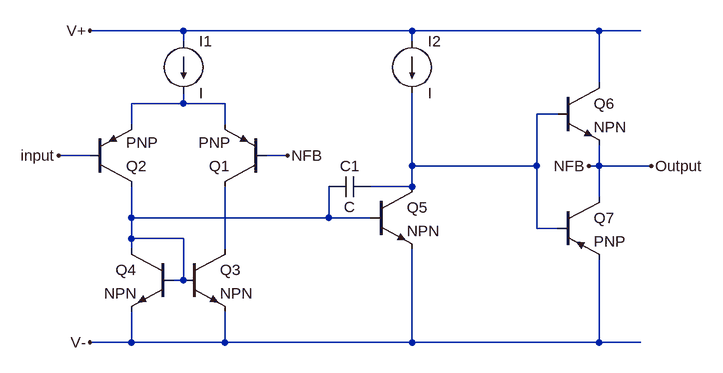
[diagram p0: schematic three_stage_pa.asc]
three_stage_pa.asc, the LTspice schematic file:
Version 4
SHEET 1 880 680
WIRE -192 32 -336 32
WIRE 160 32 -192 32
WIRE 448 32 160 32
WIRE 512 32 448 32
WIRE -192 48 -192 32
WIRE 160 48 160 32
WIRE 448 112 448 32
WIRE -192 144 -192 128
WIRE -192 144 -272 144
WIRE -128 144 -192 144
WIRE 384 160 352 160
WIRE -272 176 -272 144
WIRE -128 176 -128 144
WIRE -336 224 -384 224
WIRE -32 224 -64 224
WIRE 160 240 160 128
WIRE 352 240 352 160
WIRE 352 240 160 240
WIRE 448 240 448 208
WIRE 448 240 432 240
WIRE 528 240 448 240
WIRE 160 272 160 240
WIRE 160 272 96 272
WIRE 448 288 448 240
WIRE -272 320 -272 272
WIRE 32 320 32 272
WIRE 32 320 -272 320
WIRE 96 320 32 320
WIRE 352 336 352 240
WIRE 384 336 352 336
WIRE -272 352 -272 320
WIRE -192 352 -272 352
WIRE -272 368 -272 352
WIRE -128 368 -128 272
WIRE -192 416 -192 352
WIRE -192 416 -208 416
WIRE -272 512 -272 464
WIRE -272 512 -336 512
WIRE -128 512 -128 464
WIRE -128 512 -272 512
WIRE 160 512 160 368
WIRE 160 512 -128 512
WIRE 448 512 448 384
WIRE 448 512 160 512
WIRE 512 512 448 512
FLAG -384 224 input
FLAG -32 224 NFB
FLAG -336 32 V+
FLAG -336 512 V-
FLAG 528 240 Output
FLAG 432 240 NFB
SYMBOL current -192 48 R0
SYMATTR InstName I1
SYMBOL pnp -64 272 R180
SYMATTR InstName Q1
SYMBOL pnp -336 272 M180
SYMATTR InstName Q2
SYMBOL npn -192 368 R0
SYMATTR InstName Q3
SYMBOL npn -208 368 M0
SYMATTR InstName Q4
SYMBOL npn 96 272 R0
SYMATTR InstName Q5
SYMBOL cap 96 256 R90
WINDOW 0 0 32 VBottom 2
WINDOW 3 32 32 VTop 2
SYMATTR InstName C1
SYMBOL current 160 48 R0
SYMATTR InstName I2
SYMBOL npn 384 112 R0
SYMATTR InstName Q6
SYMBOL pnp 384 288 R0
SYMATTR InstName Q7

The netlist it stands for:
* three_stage_pa.asc
I1 V+ N001 I
Q1 N004 Output N001 0 PNP
Q2 N003 input N001 0 PNP
Q3 N004 N003 V- 0 NPN
Q4 N003 N003 V- 0 NPN
Q5 N002 N003 V- 0 NPN
C1 N002 N003 C
I2 V+ N002 I
Q6 V+ N002 Output 0 NPN
Q7 Output N002 V- 0 PNP
.model NPN NPN
.model PNP PNP
.lib standard.bjt
.backanno
.end